# Altium schematic sheet 18_40Pin_GPIO_expansion_heade.SchDoc: C200
size 439 x 311 mm; Page Create Date: March  8, 1995; Page Number: 18; Page Size: Custom; Comment: radxa_1010; Page Count: 21; RevCode: V1.11; Doc: 18_40Pin_GPIO_expansion_heade; DsnPath: D:\WMS\C200\CC122\对外\C200 V1.11.DSN; SchematicName: c200; PageName: 18_40Pin_GPIO_expansion_heade; PageSize: Custom; TopSchematic: True
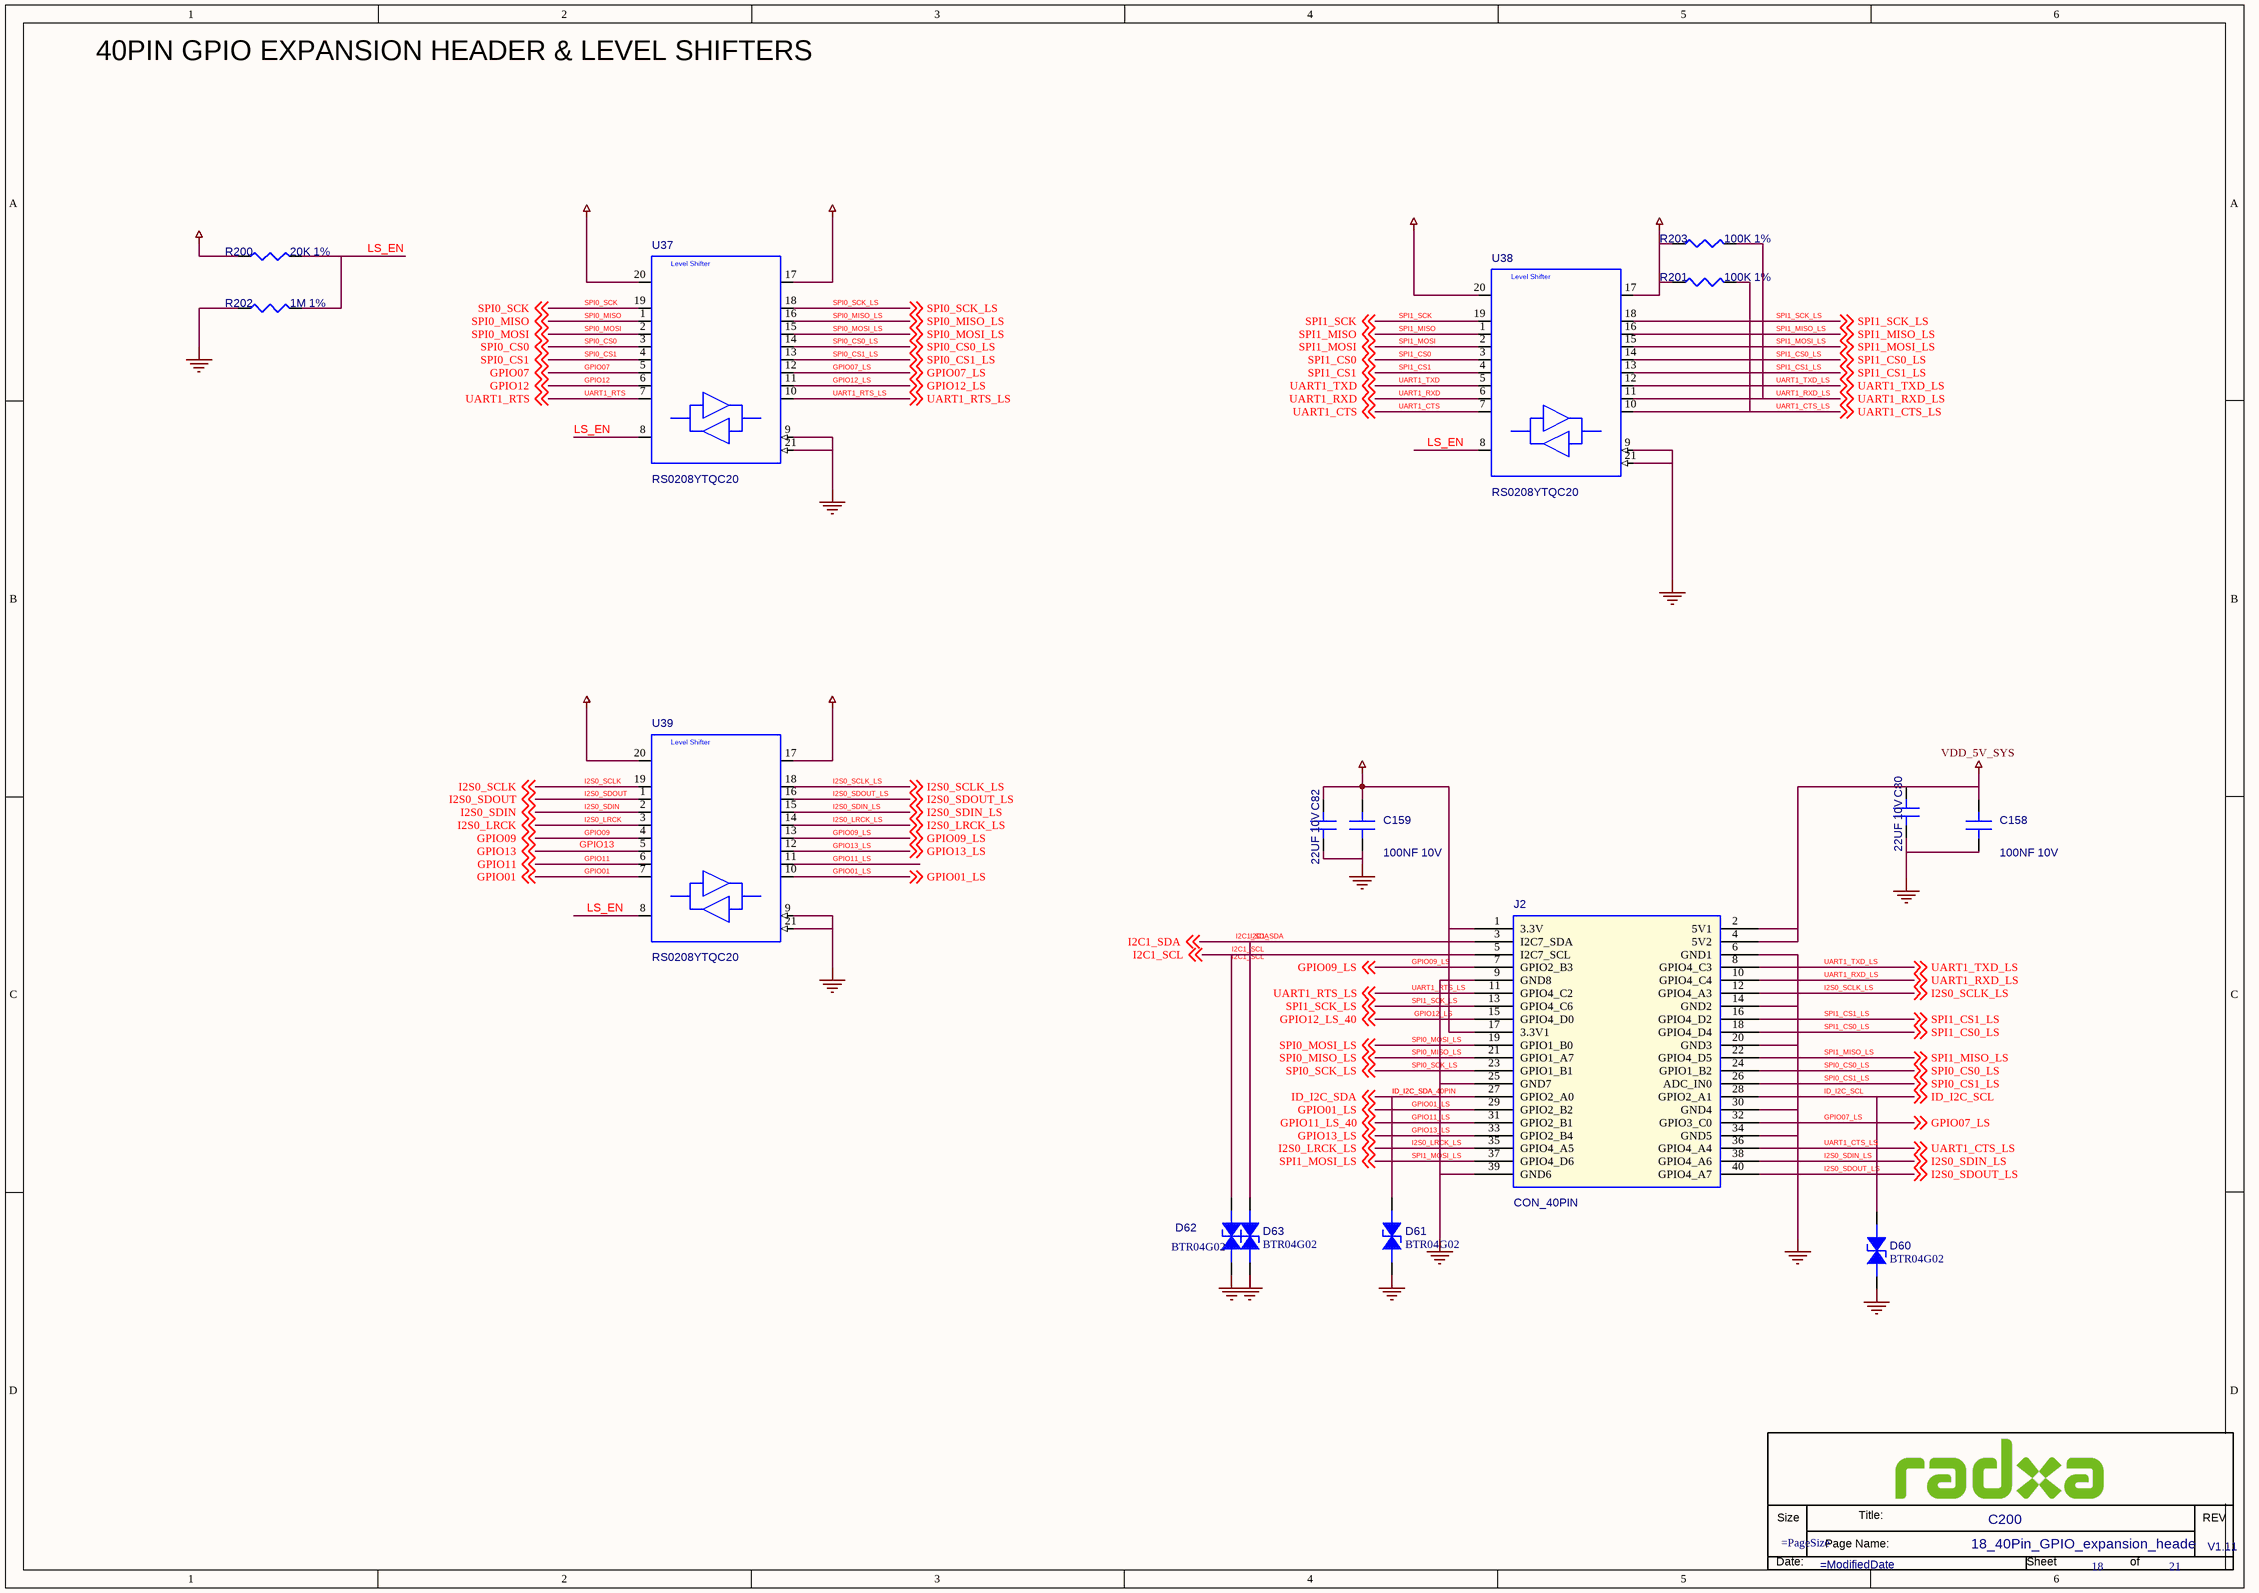
[diagram p0: 18_40Pin_GPIO_expansion_heade.SchDoc]

## Parts
*  Doc: 18_40Pin_GPIO_expansion_heade  RevCode: V1.11  Title: C200  Page Number: 18  Page Count: 21  (hidden comment: radxa_1010)  (graphical)
C80  22UF 10V  [C0603]
C82  22UF 10V  [C0603]
C158  100NF 10V  [C0402]
C159  100NF 10V  [C0402]
D60  BTR04G02  [DFN1006-2L]
D61  BTR04G02  [DFN1006-2L]
D62  BTR04G02  [DFN1006-2L]
D63  BTR04G02  [DFN1006-2L]
J2  CON_40PIN  [CON_TH20X2_2D54_STA]
R200  20K 1%  [R0402]
R201  100K 1%  [R0402]
R202  1M 1%  [R0402]
R203  100K 1%  [R0402]
U37  RS0208YTQC20  [QFN20_0D4_3]
U38  RS0208YTQC20  [QFN20_0D4_3]
U39  RS0208YTQC20  [QFN20_0D4_3]

## Nets
GND: C80.2(B) C82.2(B) C158.2(B) C159.2(B) D60.1(ANODE) D61.1(ANODE) D62.1(ANODE) D63.1(ANODE) J2.6(GND1) J2.9(GND8) J2.14(GND2) J2.20(GND3) J2.25(GND7) J2.30(GND4) J2.34(GND5) J2.39(GND6) R202.1 U37.9(GND) U37.21(EP) U38.9(GND) U38.21(EP) U39.9(GND) U39.21(EP)
VDD_1V8: R200.1 U37.20(VCCA) U38.20(VCCA) U39.20(VCCA)
VDD_3V3_SYS: C82.1(A) C159.1(A) J2.1(3.3V) J2.17(3.3V1) R201.1 R203.1 U37.17(VCCB) U38.17(VCCB) U39.17(VCCB)
VDD_5V_SYS: C80.1(A) C158.1(A) J2.2(5V1) J2.4(5V2)
GPIO01: U39.7(A8) ; off-sheet GPIO01
GPIO01_LS: J2.29(GPIO2_B2) U39.10(B8) ; off-sheet GPIO01_LS
GPIO07: U37.5(A6) ; off-sheet GPIO07
GPIO07_LS: J2.32(GPIO3_C0) U37.12(B6) ; off-sheet GPIO07_LS
GPIO09: U39.4(A5) ; off-sheet GPIO09
GPIO09_LS: J2.7(GPIO2_B3) U39.13(B5) ; off-sheet GPIO09_LS
GPIO11: U39.6(A7) ; off-sheet GPIO11
GPIO11_LS: J2.31(GPIO2_B1) U39.11(B7) ; off-sheet GPIO11_LS_40  [also labelled GPIO11_LS_40]
GPIO12: U37.6(A7) ; off-sheet GPIO12
GPIO12_LS: J2.15(GPIO4_D0) U37.11(B7) ; off-sheet GPIO12_LS, off-sheet GPIO12_LS_40  [also labelled GPIO12_LS_40]
GPIO13: U39.5(A6) ; off-sheet GPIO13
GPIO13_LS: J2.33(GPIO2_B4) U39.12(B6) ; off-sheet GPIO13_LS
I2C1_SCL: D62.2(CATHODE) J2.5(I2C7_SCL) ; off-sheet I2C1_SCL
I2C1_SDA: D63.2(CATHODE) J2.3(I2C7_SDA) ; off-sheet I2C1_SDA
I2S0_LRCK: U39.3(A4) ; off-sheet I2S0_LRCK
I2S0_LRCK_LS: J2.35(GPIO4_A5) U39.14(B4) ; off-sheet I2S0_LRCK_LS
I2S0_SCLK: U39.19(A1) ; off-sheet I2S0_SCLK
I2S0_SCLK_LS: J2.12(GPIO4_A3) U39.18(B1) ; off-sheet I2S0_SCLK_LS
I2S0_SDIN: U39.2(A3) ; off-sheet I2S0_SDIN
I2S0_SDIN_LS: J2.38(GPIO4_A6) U39.15(B3) ; off-sheet I2S0_SDIN_LS
I2S0_SDOUT: U39.1(A2) ; off-sheet I2S0_SDOUT
I2S0_SDOUT_LS: J2.40(GPIO4_A7) U39.16(B2) ; off-sheet I2S0_SDOUT_LS
ID_I2C_SCL: D60.2(CATHODE) J2.28(GPIO2_A1) ; off-sheet ID_I2C_SCL
ID_I2C_SDA: D61.2(CATHODE) J2.27(GPIO2_A0) ; off-sheet ID_I2C_SDA  [also labelled ID_I2C_SDA_40PIN]
LS_EN: R200.2 R202.2 U37.8(OE) U38.8(OE) U39.8(OE)
SPI0_CS0: U37.3(A4) ; off-sheet SPI0_CS0
SPI0_CS0_LS: J2.24(GPIO1_B2) U37.14(B4) ; off-sheet SPI0_CS0_LS
SPI0_CS1: U37.4(A5) ; off-sheet SPI0_CS1
SPI0_CS1_LS: J2.26(ADC_IN0) U37.13(B5) ; off-sheet SPI0_CS1_LS
SPI0_MISO: U37.1(A2) ; off-sheet SPI0_MISO
SPI0_MISO_LS: J2.21(GPIO1_A7) U37.16(B2) ; off-sheet SPI0_MISO_LS
SPI0_MOSI: U37.2(A3) ; off-sheet SPI0_MOSI
SPI0_MOSI_LS: J2.19(GPIO1_B0) U37.15(B3) ; off-sheet SPI0_MOSI_LS
SPI0_SCK: U37.19(A1) ; off-sheet SPI0_SCK
SPI0_SCK_LS: J2.23(GPIO1_B1) U37.18(B1) ; off-sheet SPI0_SCK_LS
SPI1_CS0: U38.3(A4) ; off-sheet SPI1_CS0
SPI1_CS0_LS: J2.18(GPIO4_D4) U38.14(B4) ; off-sheet SPI1_CS0_LS
SPI1_CS1: U38.4(A5) ; off-sheet SPI1_CS1
SPI1_CS1_LS: J2.16(GPIO4_D2) U38.13(B5) ; off-sheet SPI1_CS1_LS
SPI1_MISO: U38.1(A2) ; off-sheet SPI1_MISO
SPI1_MISO_LS: J2.22(GPIO4_D5) U38.16(B2) ; off-sheet SPI1_MISO_LS
SPI1_MOSI: U38.2(A3) ; off-sheet SPI1_MOSI
SPI1_MOSI_LS: J2.37(GPIO4_D6) U38.15(B3) ; off-sheet SPI1_MOSI_LS
SPI1_SCK: U38.19(A1) ; off-sheet SPI1_SCK
SPI1_SCK_LS: J2.13(GPIO4_C6) U38.18(B1) ; off-sheet SPI1_SCK_LS
UART1_CTS: U38.7(A8) ; off-sheet UART1_CTS
UART1_CTS_LS: J2.36(GPIO4_A4) R201.2 U38.10(B8) ; off-sheet UART1_CTS_LS
UART1_RTS: U37.7(A8) ; off-sheet UART1_RTS
UART1_RTS_LS: J2.11(GPIO4_C2) U37.10(B8) ; off-sheet UART1_RTS_LS
UART1_RXD: U38.6(A7) ; off-sheet UART1_RXD
UART1_RXD_LS: J2.10(GPIO4_C4) R203.2 U38.11(B7) ; off-sheet UART1_RXD_LS
UART1_TXD: U38.5(A6) ; off-sheet UART1_TXD
UART1_TXD_LS: J2.8(GPIO4_C3) U38.12(B6) ; off-sheet UART1_TXD_LS

## Notes on the sheet
- 40PIN GPIO EXPANSION HEADER & LEVEL SHIFTERS
- (in symbol radxa_1010) Size; Title:; REV; Page Name:; Date:; Sheet; of
- (in symbol RS0208) Level Shifter

## Library data of the parts
C80 = C: SMD  0603  22UF  10V  X5R  ±20%  ROHS; PARTS: 1; Part Reference: C80; Part Number: A1C01.00015; OriginalSymbolOrigin: (0,30); PKG_TYPE: CAP2-100-250; LEVEL: STD; PINSWAP: (A,B); Value: 22UF 10V; Part Type: 陶瓷电容; PCB Footprint: C0603
C82 = C: SMD  0603  22UF  10V  X5R  ±20%  ROHS; PARTS: 1; Part Reference: C82; Part Number: A1C01.00015; OriginalSymbolOrigin: (0,30); PKG_TYPE: CAP2-100-250; LEVEL: STD; PINSWAP: (A,B); Value: 22UF 10V; Part Type: 陶瓷电容; PCB Footprint: C0603
C158 = C: SMD  0402  100NF  10V  X5R  ±10%  ROHS; PARTS: 1; Part Reference: C158; Part Number: A1C01.00163; OriginalSymbolOrigin: (0,30); PKG_TYPE: CAP2-100-250; LEVEL: STD; PINSWAP: (A,B); Value: 100NF 10V; Part Type: 陶瓷电容; PCB Footprint: C0402
C159 = C: SMD  0402  100NF  10V  X5R  ±10%  ROHS; PARTS: 1; Part Reference: C159; Part Number: A1C01.00163; OriginalSymbolOrigin: (0,30); PKG_TYPE: CAP2-100-250; LEVEL: STD; PINSWAP: (A,B); Value: 100NF 10V; Part Type: 陶瓷电容; PCB Footprint: C0402
D60 = ESD: SMD  编带  0402  BTR04G02  B-tron  ROHS; Part Reference: D60; Part Number: A1D02.00002; Parameter: ESD-台舟 ESD5341N-封装 esd0402; ID: DE-E0004; Temp Coeff: -50℃ ~ +125℃; PCB Footprint: ESD_D0402; Value: BTR04G02; Part Type: 二极管-ESD管-桥堆-TVS管
D61 = ESD: SMD  编带  0402  BTR04G02  B-tron  ROHS; Part Reference: D61; Part Number: A1D02.00002; Parameter: ESD-台舟 ESD5341N-封装 esd0402; ID: DE-E0004; Temp Coeff: -50℃ ~ +125℃; PCB Footprint: ESD_D0402; Value: BTR04G02; Part Type: 二极管-ESD管-桥堆-TVS管
D62 = ESD: SMD  编带  0402  BTR04G02  B-tron  ROHS; Part Reference: D62; Part Number: A1D02.00002; Parameter: ESD-台舟 ESD5341N-封装 esd0402; ID: DE-E0004; Temp Coeff: -50℃ ~ +125℃; PCB Footprint: ESD_D0402; Value: BTR04G02; Part Type: 二极管-ESD管-桥堆-TVS管
D63 = ESD: SMD  编带  0402  BTR04G02  B-tron  ROHS; Part Reference: D63; Part Number: A1D02.00002; Parameter: ESD-台舟 ESD5341N-封装 esd0402; ID: DE-E0004; Temp Coeff: -50℃ ~ +125℃; PCB Footprint: ESD_D0402; Value: BTR04G02; Part Type: 二极管-ESD管-桥堆-TVS管
J2 = CON_SM2X20: DIP  排针座  2*20PIN  180度  2.54mm脚距  中间朔高2.5mm  针长一端6.1mm  另一端3mm  彩色  PH2.54  2*20P  彩印 L=11.6/3.0  国意英  ROHS; Part Reference: J2; Part Number: A1J01.00012; Value: CON_40PIN; Part Type: 排座; PCB Footprint: CON_TH20X2_2D54_STA
R200 = R: SMD  0402  20K  1/16W  ±1%  ROHS; Part Reference: R200; Part Number: A1R01.00360; PCB Footprint: R0402; Value: 20K 1%; Part Type: 贴片电阻
R201 = R: SMD  0402  100K  1/16W  ±1%  ROHS; Part Reference: R201; Part Number: A1R01.00031; Temp Coeff: －55℃ ~ ＋155℃; PCB Footprint: R0402; Value: 100K 1%; Part Type: 贴片电阻
R202 = R: SMD  0402  1M  1/16W  ±1%  ROHS; Part Reference: R202; Part Number: A1R01.00454; PCB Footprint: R0402; Value: 1M 1%; Part Type: 贴片电阻
R203 = R: SMD  0402  100K  1/16W  ±1%  ROHS; Part Reference: R203; Part Number: A1R01.00031; Temp Coeff: －55℃ ~ ＋155℃; PCB Footprint: R0402; Value: 100K 1%; Part Type: 贴片电阻
U37 = RS0208: SMD  转换器/电平移位器  RS0208YTQC20  QFN3*3-20L  RUNIC(润石)  ROHS; Part Reference: U37; Part Number: A1I01.00775; OriginalSymbolOrigin: (-250,350); CDS_LMAN_SYM_OUTLINE: -250,350,250,-450; Temp Coeff: -40°C to +85°C; SKU: COMMON; PLACEMENT_NOTE: ?; PATH: ?; PACK_TYPE: ?; NV_PN: ?; NV_NAME: ?; FUNCTION: ?; ASSEMBLY: ?; Value: RS0208YTQC20; Part Type: 集成电路/模块; PCB Footprint: QFN20_0D4_3
U38 = RS0208: SMD  转换器/电平移位器  RS0208YTQC20  QFN3*3-20L  RUNIC(润石)  ROHS; Part Reference: U38; Part Number: A1I01.00775; OriginalSymbolOrigin: (-250,350); CDS_LMAN_SYM_OUTLINE: -250,350,250,-450; Temp Coeff: -40°C to +85°C; SKU: COMMON; PLACEMENT_NOTE: ?; PATH: ?; PACK_TYPE: ?; NV_PN: ?; NV_NAME: ?; FUNCTION: ?; ASSEMBLY: ?; Value: RS0208YTQC20; Part Type: 集成电路/模块; PCB Footprint: QFN20_0D4_3
U39 = RS0208: SMD  转换器/电平移位器  RS0208YTQC20  QFN3*3-20L  RUNIC(润石)  ROHS; Part Reference: U39; Part Number: A1I01.00775; OriginalSymbolOrigin: (-250,350); CDS_LMAN_SYM_OUTLINE: -250,350,250,-450; Temp Coeff: -40°C to +85°C; SKU: COMMON; PLACEMENT_NOTE: ?; PATH: ?; PACK_TYPE: ?; NV_PN: ?; NV_NAME: ?; FUNCTION: ?; ASSEMBLY: ?; Value: RS0208YTQC20; Part Type: 集成电路/模块; PCB Footprint: QFN20_0D4_3
* = radxa_1010: Page Create Date: March  8, 1995; Page Size: =PageSize; Page Modify Date: =ModifiedDate